# Altium schematic sheet OpticalSensor.SchDoc
size A; SheetNumber: 1; SheetTotal: 5
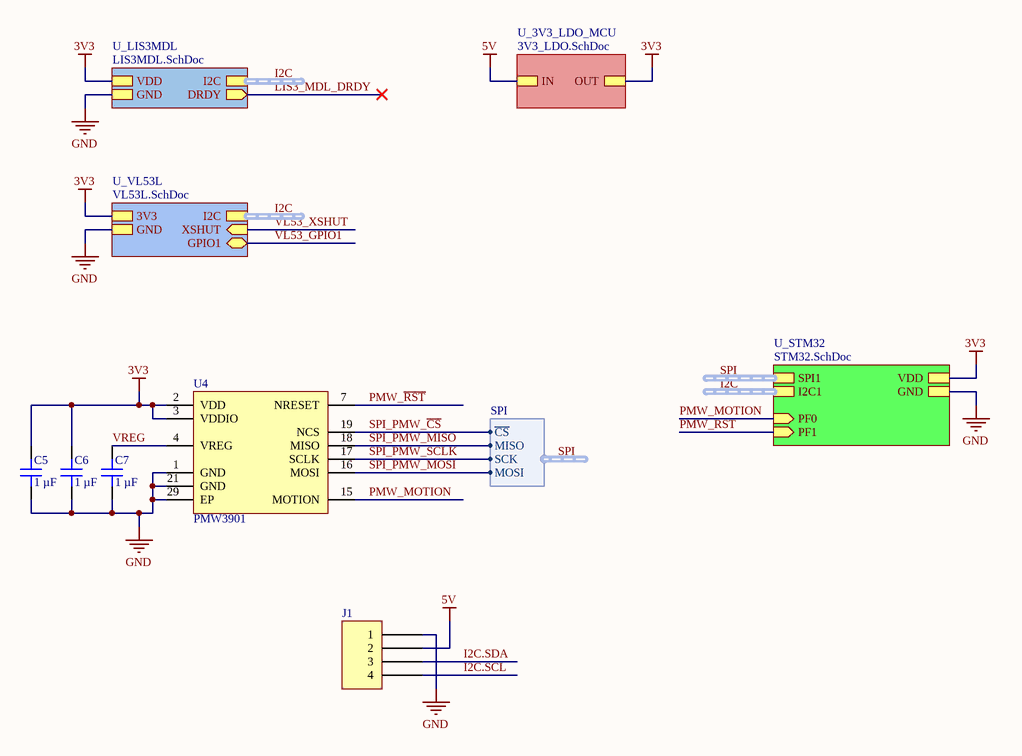
[diagram p0: OpticalSensor.SchDoc]

## Parts
C5  1 µF  [CAP 0402_1005]
C6  1 µF  [CAP 0402_1005]
C7  1 µF  [CAP 0402_1005]
J1  SM04B-SRSS-TB(LF)(SN)  [JST SM04B-SRSS-TB]  (value not drawn)
U4  PMW3901  [PMW3901]

## Sub-sheets
U_3V3_LDO_MCU = 3V3_LDO.SchDoc: OUT, IN
U_LIS3MDL = LIS3MDL.SchDoc: VDD, GND, I2C (harness I2C), DRDY (out)
U_STM32 = STM32.SchDoc: VDD, GND, SPI1 (harness SPI), I2C1 (harness I2C), PF0 (in), PF1 (in)
U_VL53L = VL53L.SchDoc: 3V3, GND, XSHUT (in), GPIO1 (bidir), I2C (harness I2C)

## Harnesses
SPI: MOSI, MISO, SCK, ~{CS}

## Nets
3V3: C5.2 C6.2 U4.2(VDD) U4.3(VDDIO) ; sheet U_3V3_LDO_MCU/OUT, sheet U_LIS3MDL/VDD, sheet U_STM32/VDD, sheet U_VL53L/3V3
5V: J1.2 ; sheet U_3V3_LDO_MCU/IN
GND: C5.1 C6.1 C7.1 J1.1 U4.1(GND) U4.21(GND) U4.29(EP) ; sheet U_LIS3MDL/GND, sheet U_STM32/GND, sheet U_VL53L/GND
I2C.SCL: J1.4
I2C.SDA: J1.3
LIS3_MDL_DRDY: sheet U_LIS3MDL/DRDY
PMW_MOTION: U4.15(MOTION) ; sheet U_STM32/PF0
PMW_~{RST}: U4.7(NRESET) ; sheet U_STM32/PF1
SPI_PMW_~{CS}: U4.19(NCS) ; sheet U_STM32/SPI1.~{CS}  [project net SPI.~{CS}]
SPI_PMW_MISO: U4.18(MISO) ; sheet U_STM32/SPI1.MISO  [project net SPI.MISO]
SPI_PMW_MOSI: U4.16(MOSI) ; sheet U_STM32/SPI1.MOSI  [project net SPI.MOSI]
SPI_PMW_SCLK: U4.17(SCLK) ; sheet U_STM32/SPI1.SCK  [project net SPI.SCK]
VL53_GPIO1: sheet U_VL53L/GPIO1
VL53_XSHUT: sheet U_VL53L/XSHUT
VREG: C7.2 U4.4(VREG)

## Buses and harness runs
harness I2C = sheet U_LIS3MDL/I2C
harness I2C = sheet U_STM32/I2C1
harness I2C = sheet U_VL53L/I2C
harness SPI = sheet U_STM32/SPI1

## Library data of the parts
C5-C7 = C0402C104K4RACAUTO: CAP CER 0.1UF 16V X7R 0402; manufacturer: KEMET; Capacitance: 0.1 µF; Tolerance: ±10%; Part Number: C0402C104K4RACAUTO; Value: 1 µF; Applications: Automotive, Bypass, Decoupling; componentlink1description: Datasheet; componentlink1url: https://api.kemet.com/component-edge/download/specsheet/C0402C104K4RACAUTO.pdf; componentlink2description: DigiKey Link; componentlink2url: https://www.digikey.com/en/products/detail/kemet/C0402C104K4RACAUTO/3314827; Device Package: 0402 (1005 Metric); lastupdated: 8/14/2022 9:05:51 PM; Lifecycle Status: Active; Minimum Order: 1; Mounting Type: Surface Mount, MLCC; Operating Temperature: -55°C ~ 125°C; Package / Case: 0402 (1005 Metric); packaging: TapeAndReel; partid: 3024; Part Status: Active; price: 0.01; Ratings: AEC-Q200; series: SMD Auto X7R; Size / Dimension: 0.039" L x 0.020" W (1.00mm x 0.50mm); Supplier 1: DigiKey; Supplier Part Number 1: 399-6828-1-ND; Temperature Coefficient: X7R; Thickness (Max): 0.022" (0.55mm); Voltage - Rated: 16V
J1 = SM04B-SRSS-TB(LF)(SN): CONN HEADER SMD R/A 4POS 1MM; Manufacturer: JST Sales America Inc.; Current Rating (Amps): 0.7A; Material Flammability Rating: UL94 V-0; Number of Positions: 4; Number of Positions Loaded: All; Pitch - Mating: 0.039" (1.00mm); Shrouding: Shrouded - 4 Wall; Style: Board to Cable/Wire; Voltage Rating: 50V; Part Number: SM04B-SRSS-TB(LF)(SN); ComponentLink1Description: Datasheet; ComponentLink1URL: http://www.jst-mfg.com/product/pdf/eng/eSH.pdf; ComponentLink2Description: DigiKey Link; ComponentLink2URL: http://digikey.com/product-detail/en/jst-sales-america-inc/SM04B-SRSS-TB-LF-SN/455-1804-1-ND/926875; Connector Type: Header; Contact Finish - Mating: Tin; Contact Finish - Post: Tin; Contact Material: Copper Alloy; Contact Shape: Square; Contact Type: Male Pin; Fastening Type: Push-Pull; Features: Solder Retention; Insulation Color: Natural; Insulation Height: 0.114" (2.90mm); Insulation Material: Polyamide (PA), Nylon; LastUpdated: 1/12/2020 11:41:52 PM; Lifecycle Status: Active; Minimum Order: 1; Mounting Type: Surface Mount, Right Angle; Number of Rows: 1; Operating Temperature: -25°C ~ 85°C; Packaging: TapeAndReel; PartId: 62; Part Status: Active; Price: 0.26; Series: SR; Supplier 1: DigiKey; Supplier Part Number 1: 455-1804-1-ND; Termination: Solder
U4 = PMW3901: PMW3901. Optical Flow Sensor